# EasyEDA Pro project ProPrj_Maggy 4.1_2025-02-07.epro, schematic Schematic1
Board Name: Board1; Create Date: 2025-01-22; Page Name: P1; Project Name: Maggy 4.0 (Eurocircuit mods); Schematic Name: Schematic1; Update Date: 2025-01-22; Company: NTNU; Drawn: NTNU; Page Size: A4; Part Number: Main Board; Reviewed: 23/10/2024; Version: V4.0
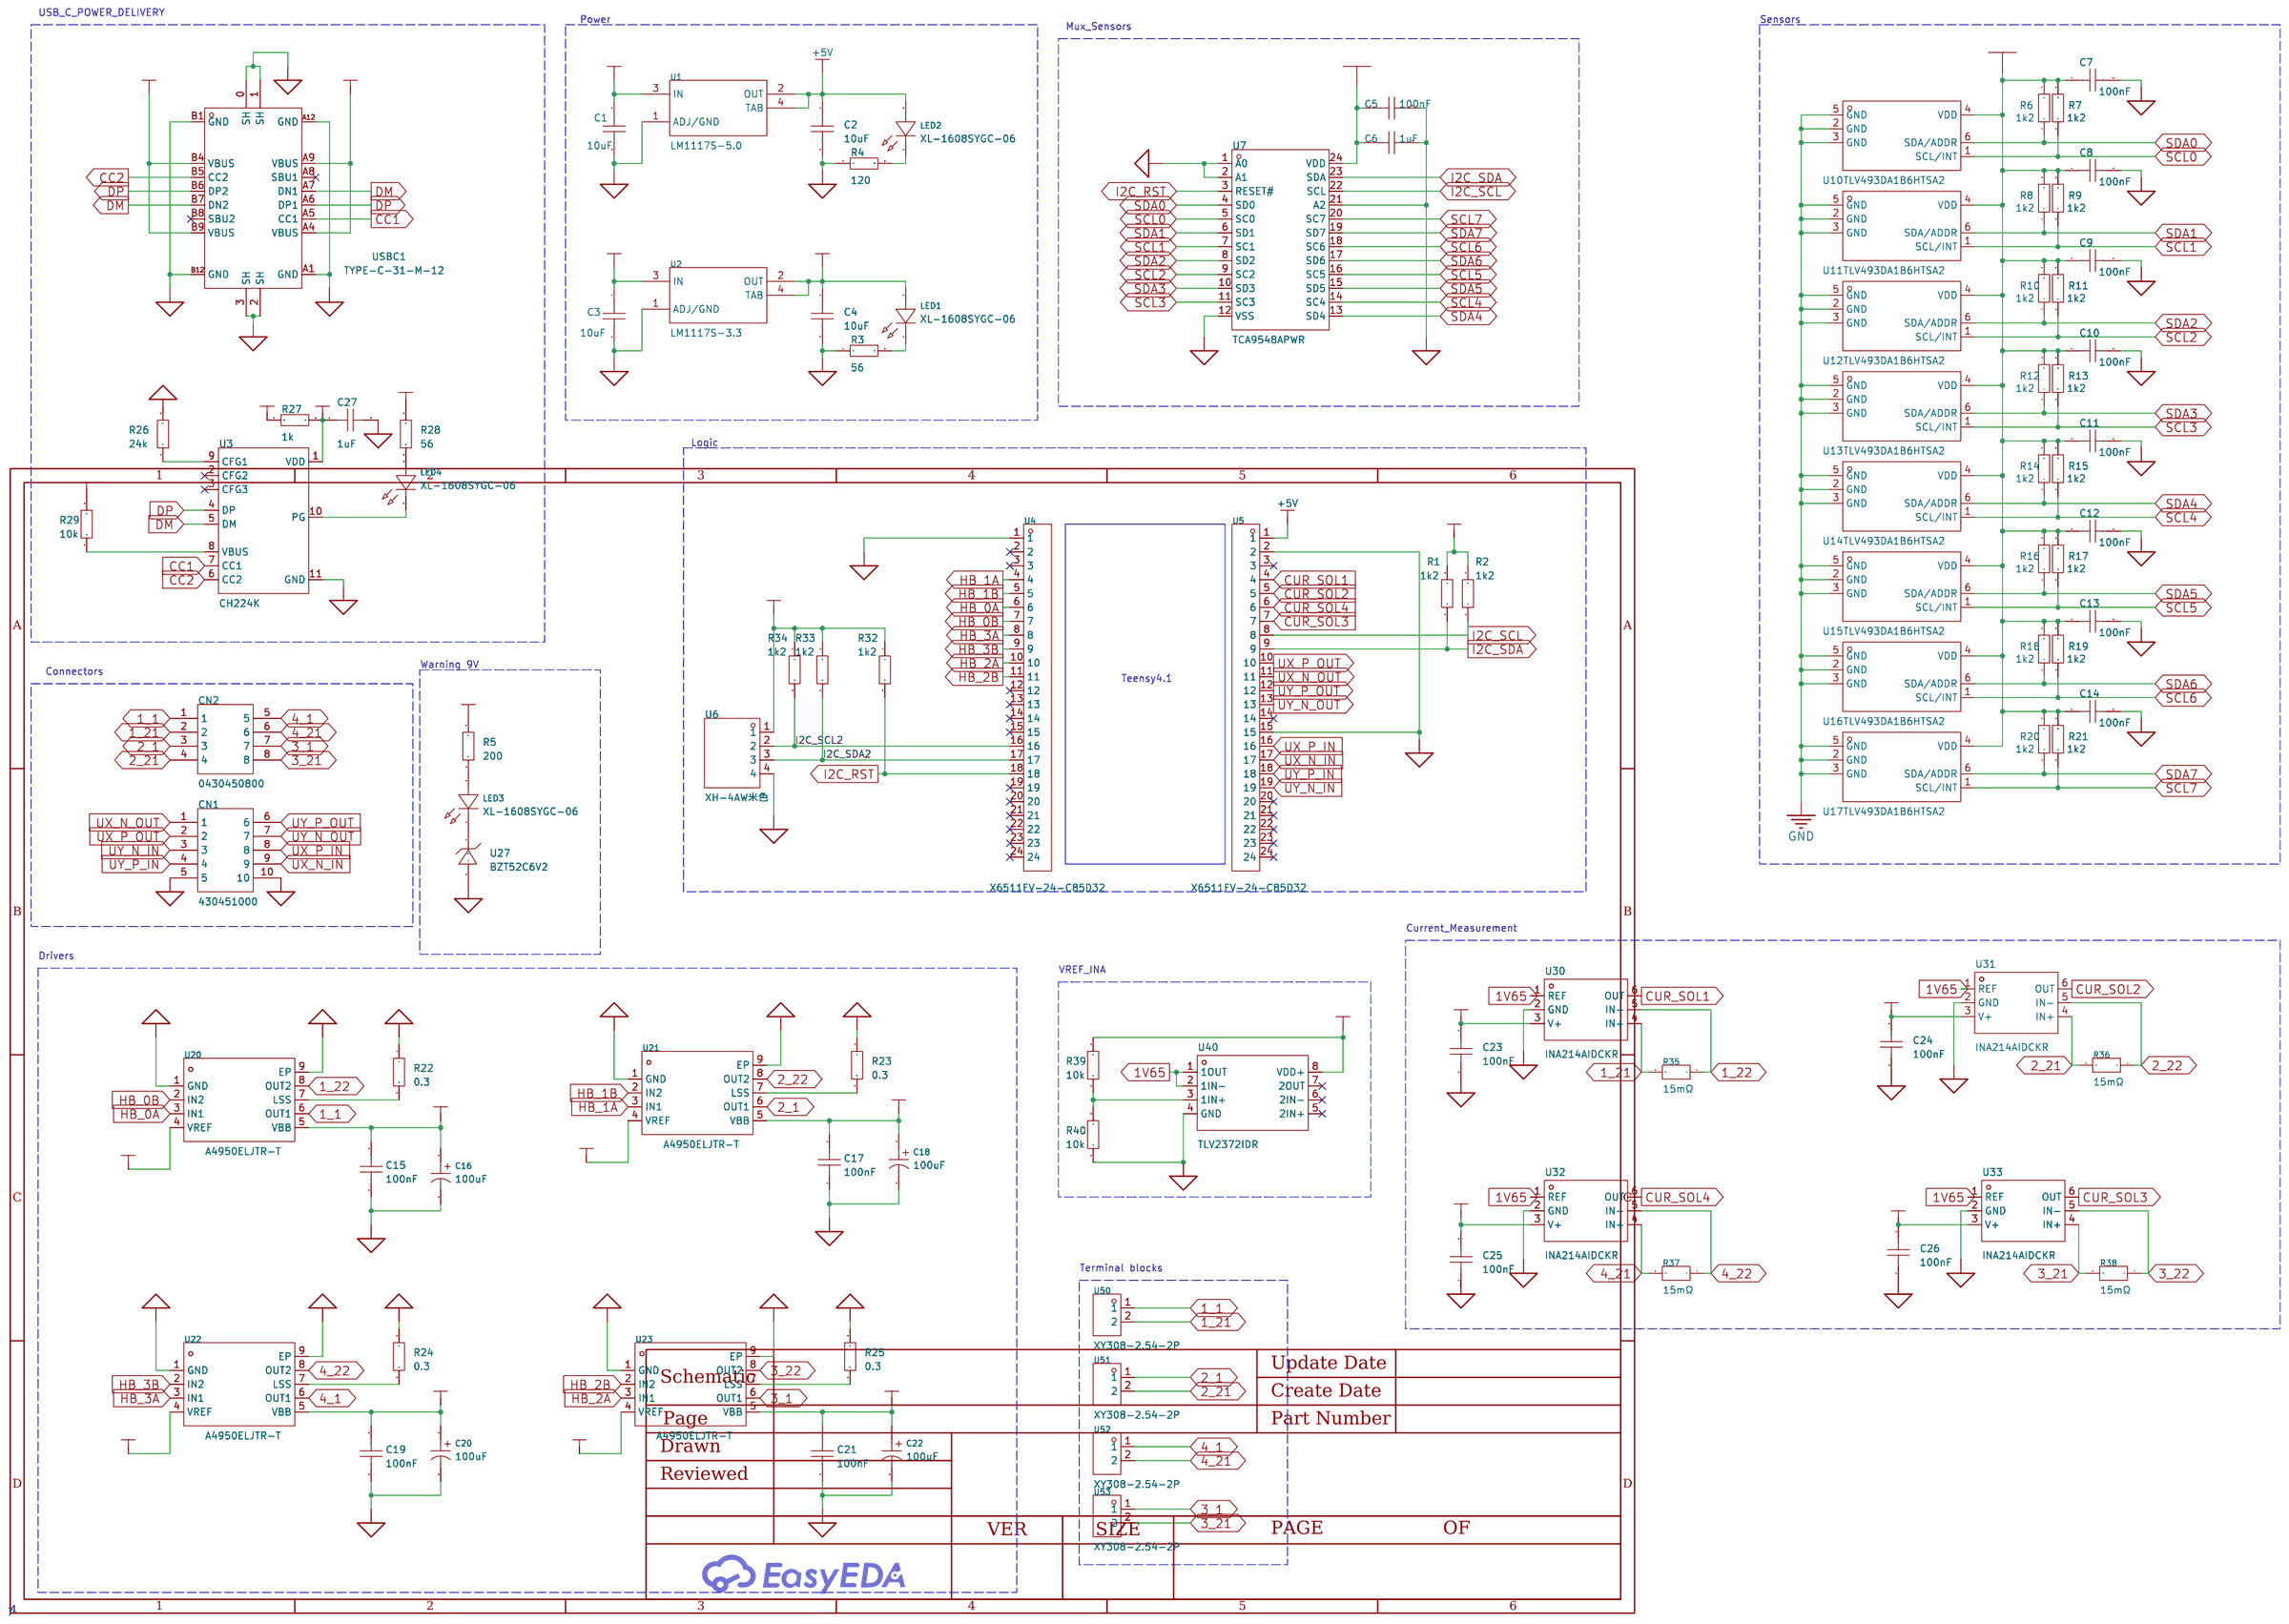
[diagram p0: schematic sheet]

## Parts
C1  10uF  [C0805]
C2  10uF  [C0805]
C3  10uF  [C0805]
C4  10uF  [C0805]
C5  100nF  [C0603]
C6  1uF  [C0805]
C7  100nF  [C0603]
C8  100nF  [C0603]
C9  100nF  [C0603]
C10  100nF  [C0603]
C11  100nF  [C0603]
C12  100nF  [C0603]
C13  100nF  [C0603]
C14  100nF  [C0603]
C15  100nF  [C0603]
C16  100uF  [CAP-SMD_BD6.3-L6.6-W6.6-LS7.2-FD]
C17  100nF  [C0603]
C18  100uF  [CAP-SMD_BD6.3-L6.6-W6.6-LS7.2-FD]
C19  100nF  [C0603]
C20  100uF  [CAP-SMD_BD6.3-L6.6-W6.6-LS7.2-FD]
C21  100nF  [C0603]
C22  100uF  [CAP-SMD_BD6.3-L6.6-W6.6-LS7.2-FD]
C23  100nF  [C0603]
C24  100nF  [C0603]
C25  100nF  [C0603]
C26  100nF  [C0603]
C27  1uF  [C0805]
CN1  430451000  [CONN-TH_43045-1000]
CN2  0430450800  [CONN-TH_0430450800]
LED1  XL-1608SYGC-06  [LED0603-RD_GREEN]
LED2  XL-1608SYGC-06  [LED0603-RD_GREEN]
LED3  XL-1608SYGC-06  [LED0603-RD_GREEN]
LED4  XL-1608SYGC-06  [LED0603-RD_GREEN]
R1  1k2  [R0805]
R2  1k2  [R0805]
R3  56  [R0603]
R4  120  [R0603]
R5  200  [R0603]
R6  1k2  [R0805]
R7  1k2  [R0805]
R8  1k2  [R0805]
R9  1k2  [R0805]
R10  1k2  [R0805]
R11  1k2  [R0805]
R12  1k2  [R0805]
R13  1k2  [R0805]
R14  1k2  [R0805]
R15  1k2  [R0805]
R16  1k2  [R0805]
R17  1k2  [R0805]
R18  1k2  [R0805]
R19  1k2  [R0805]
R20  1k2  [R0805]
R21  1k2  [R0805]
R22  0.3  [R1206]
R23  0.3  [R1206]
R24  0.3  [R1206]
R25  0.3  [R1206]
R26  24k  [R0805]
R27  1k  [R0805]
R28  56  [R0603]
R29  10k  [R0805]
R32  1k2  [R0805]
R33  1k2  [R0805]
R34  1k2  [R0805]
R35  15mΩ  [R1206]
R36  15mΩ  [R1206]
R37  15mΩ  [R1206]
R38  15mΩ  [R1206]
R39  10k  [R0805]
R40  10k  [R0805]
U1  LM1117S-5.0  [SOT-223-3_L6.5-W3.4-P2.30-LS7.0-BR]
U2  LM1117S-3.3  [SOT-223-3_L6.5-W3.4-P2.30-LS7.0-BR]
U3  CH224K  [ESSOP-10_L4.9-W3.9-P1.0-LS6.0-TL-EP]
U4  X6511FV-24-C85D32  [HDR-TH_24P-P2.54-V-F]
U5  X6511FV-24-C85D32  [HDR-TH_24P-P2.54-V-F]
U6  XH-4AW米色  [CONN-TH_XH2.54-4AW]
U7  TCA9548APWR  [TSSOP-24_L7.8-W4.4-P0.65-LS6.4-BL]
U10  TLV493DA1B6HTSA2  [SOP-6_L3.0-W1.5-P0.95-LS2.5-BR]
U11  TLV493DA1B6HTSA2  [SOP-6_L3.0-W1.5-P0.95-LS2.5-BR]
U12  TLV493DA1B6HTSA2  [SOP-6_L3.0-W1.5-P0.95-LS2.5-BR]
U13  TLV493DA1B6HTSA2  [SOP-6_L3.0-W1.5-P0.95-LS2.5-BR]
U14  TLV493DA1B6HTSA2  [SOP-6_L3.0-W1.5-P0.95-LS2.5-BR]
U15  TLV493DA1B6HTSA2  [SOP-6_L3.0-W1.5-P0.95-LS2.5-BR]
U16  TLV493DA1B6HTSA2  [SOP-6_L3.0-W1.5-P0.95-LS2.5-BR]
U17  TLV493DA1B6HTSA2  [SOP-6_L3.0-W1.5-P0.95-LS2.5-BR]
U20  A4950ELJTR-T  [SOIC-8_L4.9-W3.9-P1.27-LS6.0-BL-EP]
U21  A4950ELJTR-T  [SOIC-8_L4.9-W3.9-P1.27-LS6.0-BL-EP]
U22  A4950ELJTR-T  [SOIC-8_L4.9-W3.9-P1.27-LS6.0-BL-EP]
U23  A4950ELJTR-T  [SOIC-8_L4.9-W3.9-P1.27-LS6.0-BL-EP]
U27  BZT52C6V2  [SOD-123_L2.7-W1.6-LS3.7-RD]
U30  INA214AIDCKR  [SC-70-6_L2.2-W1.3-P0.65-LS2.2-BR]
U31  INA214AIDCKR  [SC-70-6_L2.2-W1.3-P0.65-LS2.2-BR]
U32  INA214AIDCKR  [SC-70-6_L2.2-W1.3-P0.65-LS2.2-BR]
U33  INA214AIDCKR  [SC-70-6_L2.2-W1.3-P0.65-LS2.2-BR]
U40  TLV2372IDR  [SOIC-8_L4.9-W3.9-P1.27-LS6.0-BL]
U50  XY308-2.54-2P  [CONN-TH_XY308-2.54-2P]
U51  XY308-2.54-2P  [CONN-TH_XY308-2.54-2P]
U52  XY308-2.54-2P  [CONN-TH_XY308-2.54-2P]
U53  XY308-2.54-2P  [CONN-TH_XY308-2.54-2P]
USBC1  TYPE-C-31-M-12  [USB-C_SMD-TYPE-C-31-M-12]

## Library data of the parts
C1-C4 C27 = CAP_0805: Supplier Footprint: 0805; Check: false
C5 C7-C14 C23-C26 = CAP_0603: Supplier Footprint: 0603
C6 = CAP_0805: Supplier Footprint: 0805
C15 C17 C19 C21 = CAP_0603: Supplier Footprint: 0603; Check: false
C16 C18 C20 C22 = RST100UF35V009: Capacitance: Tolerance:±20% Tolerance:±20% Rated Voltage: Ripple Current:84mA@120Hz Equivalent Series Resistance(ESR):- φD: L: Lifetime @ Temp:2000hrs@105℃ Operating Temperature:-40℃~+105℃ Operating Temperature:-40℃~+105℃; LCSC Part Name: 100uF ±20% 35V; Supplier Part: C4747966; Manufacturer: KNSCHA(科尼盛); Supplier Footprint: SMD,D6.3xL7.7mm; JLCPCB Part Class: Extended Part; Datasheet: https://atta.szlcsc.com/upload/public/pdf/source/20220728/EE5FCA44287011E134FD5BDD3E8B91F9.pdf; Supplier: LCSC; Tolerance: ±20%; Ripple Current: 84mA@120Hz; Lifetime @ Temp: 2000hrs@105℃; Operating Temperature: -40℃~+105℃
CN1 = 430451000: Pins Structure:2x5P Pitch:3mm Mounting Style:Bend insert Reference Series:Micro-Fit(MX 3.0) Number of Pins:10P Number of Rows:2 Number of PINs Per Row:5 Row Spacing:3mm Current Rating (Max):8.5A Contact Material:Brass Contact Plating:Tin Operating Tempera; LCSC Part Name: 2x5P 间距:3mm 弯插 系列:Micro-Fit(MX 3.0); Supplier Part: C122421; Manufacturer: MOLEX; Supplier Footprint: 弯插,P=3mm; JLCPCB Part Class: Extended Part; Supplier: LCSC; Pins Structure: 2x5P; Pitch: 3mm; Mounting Style: Bend insert; Reference Series: Micro-Fit(MX 3.0); Number of Pins: 10P; Number of Rows: 2; Number of PINs Per Row: 5; Row Spacing: 3mm; Current Rating (Max): 8.5A; Contact Material: Brass; Contact Plating: Tin; Operating Temperature Range: -40℃~+105℃; Rated Voltage (Max): 600V; Flame Retardant Rating: UL94V-0; Supplementary Features: Fishhook Foot (Plastic); Colour: Black; Z-Height of the Board: 8.77mm; X-Length of Bottom Edge on Board (Spacing Line): 18.65mm; Y-Width of Bottom Edge on Board: 12.24mm
CN2 = 0430450800: Pins Structure:2x4P Pitch:3mm Mounting Style:Bend insert Reference Series:Micro-Fit(MX 3.0) Number of Pins:8P Number of Rows:2 Number of PINs Per Row:4 Row Spacing:3mm Current Rating (Max):8.5A Contact Material:Brass Contact Plating:Tin Operating Temperat; LCSC Part Name: 2x4P 间距:3mm 弯插 系列:Micro-Fit(MX 3.0); Supplier Part: C122422; Manufacturer: MOLEX; Supplier Footprint: 弯插,P=3mm; JLCPCB Part Class: Extended Part; Supplier: LCSC; Pins Structure: 2x4P; Pitch: 3mm; Mounting Style: Bend insert; Reference Series: Micro-Fit(MX 3.0); Number of Pins: 8P; Number of Rows: 2; Number of PINs Per Row: 4; Row Spacing: 3mm; Current Rating (Max): 8.5A; Contact Material: Brass; Contact Plating: Tin; Operating Temperature Range: -40℃~+105℃; Rated Voltage (Max): 600V; Flame Retardant Rating: UL94V-0; Supplementary Features: Fishhook Foot (Plastic); Colour: Black; Z-Height of the Board: 8.77mm; X-Length of Bottom Edge on Board (Spacing Line): 15.65mm; Y-Width of Bottom Edge on Board: 12.24mm
LED1 LED3 LED4 = XL-1608SYGC-06: Emitted Color:Green-yellow Power Dissipation:55mW Forward Current:25mA Dominant Wavelength:570nm~573nm Dominant Wavelength:570nm~573nm Peak Wavelength:575nm Lens Color:无色透明透镜 Color Temperature:2800K~3160K Color Temperature:2800K~3160K Viewing Angle:120° M; Supplier Part: C965805; Manufacturer: XINGLIGHT(成兴光); Supplier Footprint: 0603; JLCPCB Part Class: Extended Part; Datasheet: https://atta.szlcsc.com/upload/public/pdf/source/20221102/F362183196D461585F90F08511E6DE2E.pdf; Supplier: LCSC; Emitted Color: Green-yellow; Power Dissipation: 55mW; Forward Current: 25mA; Dominant Wavelength: 570nm~573nm; Peak Wavelength: 575nm; Lens Color: 无色透明透镜; Color Temperature: 2800K~3160K; Viewing Angle: 120°; Mounting Sytle: Positive post; Operating Temperature: -30℃~+85℃; Check: false
LED2 = XL-1608SYGC-06: Emitted Color:Green-yellow Power Dissipation:55mW Forward Current:25mA Dominant Wavelength:570nm~573nm Dominant Wavelength:570nm~573nm Peak Wavelength:575nm Lens Color:无色透明透镜 Color Temperature:2800K~3160K Color Temperature:2800K~3160K Viewing Angle:120° M; Supplier Part: C965805; Manufacturer: XINGLIGHT(成兴光); Supplier Footprint: 0603; JLCPCB Part Class: Extended Part; Datasheet: https://atta.szlcsc.com/upload/public/pdf/source/20221102/F362183196D461585F90F08511E6DE2E.pdf; Supplier: LCSC; Emitted Color: Green-yellow; Power Dissipation: 55mW; Forward Current: 25mA; Dominant Wavelength: 570nm~573nm; Peak Wavelength: 575nm; Lens Color: 无色透明透镜; Color Temperature: 2800K~3160K; Viewing Angle: 120°; Mounting Sytle: Positive post; Operating Temperature: -30℃~+85℃
R1 R2 R26 R27 R29 R39 R40 = Res_0805: Supplier Footprint: 0805; Check: false
R3-R5 R28 R32-R34 = Res_0603: Supplier Footprint: 0603; Check: false
R6-R21 = Res_0805: Supplier Footprint: 0805
R22-R25 = Res_1206: Supplier Footprint: 1206; Check: false
R35-R38 = 1206W3F100MT5E: Type:Thick Film Resistors Resistance:10mΩ Tolerance:±1% Tolerance:±1% Power(Watts): Overload Voltage (Max): Temperature Coefficient:- Temperature Coefficient:- Operating Temperature Range:-55℃~+155℃ Operating Temperature Range:-55℃~+155℃; LCSC Part Name: 10mΩ ±1% 333.333mW 厚膜电阻; Supplier Part: C473031; Manufacturer: UNI-ROYAL(厚声); Supplier Footprint: 1206; JLCPCB Part Class: Extended Part; Datasheet: https://atta.szlcsc.com/upload/public/pdf/source/20200306/C422600_1E6D84923E4A46A82E41ADD87F860B5C.pdf; Supplier: LCSC; Type: Thick Film Resistors; Tolerance: ±1%; Operating Temperature Range: -55℃~+155℃
U1 = LM1117S-5.0: Output Type: Maximum Input Voltage:12V Output Voltage:5V Output Voltage:5V MAX Output Current:1A Power Supply Rejection Ratio (PSRR):75dB@(120Hz) Dropout Voltage:1.3V@(1A) Output Polarity:Positive electrode Number of Outputs:1; Supplier: LCSC; Manufacturer: HTC; Supplier Part: C126028; JLCPCB Part Class: Extended Part; LCSC Part Name: 输入12V 输出5V 1A; Supplier Footprint: SOT-223-3; Datasheet: https://atta.szlcsc.com/upload/public/pdf/source/20170814/C126029_1502678374361885901.pdf; Maximum Input Voltage: 12V; Output Voltage: 5V; MAX Output Current: 1A; Power Supply Rejection Ratio (PSRR): 75dB@(120Hz); Dropout Voltage: 1.3V@(1A); Output Polarity: Positive electrode; Number of Outputs: 1; Check: false
U2 = LM1117S-3.3: Output Type: Maximum Input Voltage:12V Output Voltage:3.3V Output Voltage:3.3V MAX Output Current:1A Power Supply Rejection Ratio (PSRR):75dB@(120Hz) Dropout Voltage:1.3V@(1A) Output Polarity:Positive electrode Number of Outputs:1; Supplier: LCSC; Manufacturer: HTC; Supplier Part: C126027; JLCPCB Part Class: Extended Part; LCSC Part Name: 输入12V 输出3.3V 1A; Supplier Footprint: SOT-223-3; Datasheet: https://atta.szlcsc.com/upload/public/pdf/source/20170814/C126029_1502678374361885901.pdf; Maximum Input Voltage: 12V; Output Voltage: 3.3V; MAX Output Current: 1A; Power Supply Rejection Ratio (PSRR): 75dB@(120Hz); Dropout Voltage: 1.3V@(1A); Output Polarity: Positive electrode; Number of Outputs: 1; Check: false
U3 = CH224K: Applications Function:USB充电芯片; LCSC Part Name: USB PD等多快充协议受电芯片CH224; Supplier Part: C970725; Manufacturer: WCH(南京沁恒); Supplier Footprint: ESSOP-10-150mil-1mm; JLCPCB Part Class: Extended Part; Datasheet: https://atta.szlcsc.com/upload/public/pdf/source/20240313/43C2AFDDBDD1F65B60386D2CCAB0811B.pdf; Supplier: LCSC; Applications Function: USB充电芯片
U4 U5 = X6511FV-24-C85D32: Holes Structure:1x24P Pitch:2.54mm Row Spacing:- Circular Hole / Square Hole:Square Holes Mounting Type:Straight Number of Rows:Plugin Number of Holes:24P Current Rating (Max):3A Voltage Rating (Max):250V Holes Direction:Top Insulation Height:8.5mm Contac; LCSC Part Name: 间距:2.54mm 1x24P 直插; Supplier Part: C2883741; Manufacturer: XKB Connectivity(中国星坤); Supplier Footprint: 插件,P=2.54mm; JLCPCB Part Class: Extended Part; Datasheet: https://atta.szlcsc.com/upload/public/pdf/source/20211009/E31A179D77B4765F9C2936200B697B47.pdf; Supplier: LCSC; Holes Structure: 1x24P; Pitch: 2.54mm; Circular Hole / Square Hole: Square Holes; Mounting Type: Straight; Number of Rows: Plugin; Number of Holes: 24P; Current Rating (Max): 3A; Voltage Rating (Max): 250V; Holes Direction: Top; Insulation Height: 8.5mm; Contact Material: Brass; Contact Plating: Gold; Operating Temperature Range: -40℃~+105℃; Soldering Temperature(Max): 260℃
U6 = XH-4AW米色: Pins Structure:1x4P Pitch:2.5mm Mounting Style:Right-Angle Reference Series:XH Number of Pins:4P Number of Rows:1 Number of PINs Per Row:4 Row Spacing:- Contact Material:-; LCSC Part Name: 系列:XH 间距:2.5mm 1x4P; Supplier Part: C146115; Manufacturer: BOOMELE(博穆精密); Supplier Footprint: 弯插,P=2.5mm; JLCPCB Part Class: Extended Part; Datasheet: https://atta.szlcsc.com/upload/public/pdf/source/20171115/C146119_15107294155991120596.pdf; Supplier: LCSC; Pins Structure: 1x4P; Pitch: 2.5mm; Mounting Style: Right-Angle; Reference Series: XH; Number of Pins: 4P; Number of Rows: 1; Number of PINs Per Row: 4; Check: false
U7 = TCA9548APWR: Supplier Part: C130026; Manufacturer: TI(德州仪器); Supplier Footprint: TSSOP-24; JLCPCB Part Class: Extended Part; Datasheet: https://www.ti.com/cn/lit/gpn/tca9548a; Supplier: LCSC
U10-U17 = TLV493DA1B6HTSA2: Supplier: LCSC; Manufacturer: Infineon(英飞凌); Supplier Part: C126688; JLCPCB Part Class: Extended Part; LCSC Part Name: 磁场传感器; Supplier Footprint: SOP-6-1.5mm; Datasheet: https://atta.szlcsc.com/upload/public/pdf/source/20170818/C126688_1503051290851895354.pdf
U20-U23 = A4950ELJTR-T: Drive motor type:有刷直流电机 Supply Voltage:8V~40V Supply Voltage:8V~40V Output Current:3.5A Operating Temperature:-40℃~+150℃@(Tj) Operating Temperature:-40℃~+150℃@(Tj); Supplier: LCSC; Manufacturer: ALLEGRO(美国埃戈罗); Supplier Part: C82404; JLCPCB Part Class: Extended Part; Supplier Footprint: SOIC-8-EP; Datasheet: https://atta.szlcsc.com/upload/public/pdf/source/20161024/1477288450284.pdf; Drive motor type: 有刷直流电机; Supply Voltage: 8V~40V; Output Current: 3.5A; Operating Temperature: -40℃~+150℃@(Tj); Check: false
U27 = BZT52C6V2_C2910064: Diode Configuration:Single Zener Voltage (Nom):6.2V Reverse Leakage Current (Ir):3uA@4V Zener Voltage (Range):5.8V~6.6V Zener Voltage (Range):5.8V~6.6V Power Dissipation:500mW Zener Impedance (Zzt):10Ω Tolerance:- Tolerance:-; Supplier Part: C2910064; Manufacturer: CJ(江苏长电/长晶); Supplier Footprint: SOD-123; JLCPCB Part Class: Extended Part; Datasheet: https://atta.szlcsc.com/upload/public/pdf/source/20211105/0A7AF84D57D732370551C8DD7A10F563.pdf; Supplier: LCSC; Diode Configuration: Single; Zener Voltage (Nom): 6.2V; Reverse Leakage Current (Ir): 3uA@4V; Zener Voltage (Range): 5.8V~6.6V; Power Dissipation: 500mW; Zener Impedance (Zzt): 10Ω
U30-U33 = INA214AIDCKR: Number of Channels:Single channel Supply Current:65uA Operating Temperature:-40℃~+125℃ Operating Temperature:-40℃~+125℃; Supplier Part: C105240; Manufacturer: TI(德州仪器); Supplier Footprint: SOT-363(SC-70-6); JLCPCB Part Class: Extended Part; Datasheet: https://www.ti.com/cn/lit/gpn/ina214; Supplier: LCSC; Number of Channels: Single channel; Supply Current: 65uA; Operating Temperature: -40℃~+125℃
U40 = TLV2372IDR: Number of Circuits:双路 Gain Bandwidth Product(GBP):3MHz Current - Input Bias(Ib):1pA Slew Rate(SR):2.1V/us Output Current:16mA -3db Bandwidth:- Output Type:- Rail to Rail:- Operating Temperature:-40℃~+125℃ Operating Temperature:-40℃~+125℃; Supplier Part: C27204; Manufacturer: TI(德州仪器); Supplier Footprint: SOIC-8; JLCPCB Part Class: Extended Part; Datasheet: https://www.ti.com/cn/lit/gpn/tlv2372; Supplier: LCSC; Number of Circuits: 双路; Gain Bandwidth Product(GBP): 3MHz; Current - Input Bias(Ib): 1pA; Slew Rate(SR): 2.1V/us; Output Current: 16mA; Operating Temperature: -40℃~+125℃
U50-U53 = XY308-2.54-2P: Structure:1x2P Pitch:2.54mm Color:Green Mounting Style:Straight Current Rating (Max):6A Voltage Rating (Max):150V Number of Pins:2P Number of Rows:1 Wire Gauge - AWG:18~26 Wire Gauge - AWG:18~26 Wire Gauge - mm2:1 Wire Gauge - mm2:1 Number of PINs Per Row; LCSC Part Name: 2.54mm 1x2P 排数:1 每排P数:2 直插; Supplier Part: C557685; Manufacturer: XINLAIYA(新莱亚); Supplier Footprint: 插件,P=2.54mm; JLCPCB Part Class: Extended Part; Datasheet: https://atta.szlcsc.com/upload/public/pdf/source/20200527/C557686_13715264167F455C722D771DE12648FD.pdf; Supplier: LCSC; Structure: 1x2P; Pitch: 2.54mm; Color: Green; Mounting Style: Straight; Current Rating (Max): 6A; Voltage Rating (Max): 150V; Number of Pins: 2P; Number of Rows: 1; Wire Gauge - AWG: 18~26; Wire Gauge - mm2: 1; Number of PINs Per Row: 2; Check: false
USBC1 = TYPE-C-31-M-12: Connector Type:Type-C Standard:- Gender:Female Number of Ports:1 Number of Contacts:16P Mounting Style:- Current Rating - Power (Max):5A Contact Material:- Contact Plating:- Operating Temperature Range:- Operating Temperature Range:- Soldering Temperature; LCSC Part Name: Type-C 母; Supplier Part: C165948; Manufacturer: 韩国韩荣; Supplier Footprint: SMD; JLCPCB Part Class: Extended Part; Datasheet: https://atta.szlcsc.com/upload/public/pdf/source/20220525/466408E853115E789EDB0DDC29077C05.pdf; Supplier: LCSC; Connector Type: Type-C; Gender: Female; Number of Ports: 1; Number of Contacts: 16P; Current Rating - Power (Max): 5A

## Nets
1V65: U30.1(REF) U31.1(REF) U32.1(REF) U33.1(REF) U40.1(1OUT) U40.2(1IN-)
3V3: C4.1 C5.1 C6.2 C7.1 C8.1 C9.1 C10.1 C11.1 C12.1 C13.1 C14.1 C23.2 C24.2 C25.2 C26.2 C27.1 LED1.2(A) R1.2 R2.2 R6.2 R7.2 R8.2 R9.2 R10.2 R11.2 R12.2 R13.2 R14.2 R15.2 R16.2 R17.2 R18.2 R19.2 R20.2 R21.2 R27.1 R28.2 R32.1 R33.1 R34.1 R39.2 U2.2(OUT) U2.4(TAB) U3.1(VDD) U6.1 U7.24(VDD) U10.4(VDD) U11.4(VDD) U12.4(VDD) U13.4(VDD) U14.4(VDD) U15.4(VDD) U16.4(VDD) U17.4(VDD) U20.4(VREF) U21.4(VREF) U22.4(VREF) U23.4(VREF) U30.3(V+) U31.3(V+) U32.3(V+) U33.3(V+) U40.8(VDD+)
+5V: C2.1 LED2.2(A) U1.2(OUT) U1.4(TAB) U5.1
GND: C1.2 C2.2 C3.2 C4.2 C5.2 C6.1 C7.2 C8.2 C9.2 C10.2 C11.2 C12.2 C13.2 C14.2 C15.2 C16.2 C17.2 C18.2 C19.2 C20.2 C21.2 C22.2 C23.1 C24.1 C25.1 C26.1 C27.2 CN1.5 CN1.10 R3.1 R4.1 R22.1 R23.1 R24.1 R25.1 R26.2 R40.1 U1.1(ADJ/GND) U2.1(ADJ/GND) U3.11(GND) U4.1 U5.2 U5.15 U6.4 U7.1(A0) U7.2(A1) U7.12(VSS) U7.21(A2) U10.2(GND) U10.3(GND) U10.5(GND) U11.2(GND) U11.3(GND) U11.5(GND) U12.2(GND) U12.3(GND) U12.5(GND) U13.2(GND) U13.3(GND) U13.5(GND) U14.2(GND) U14.3(GND) U14.5(GND) U15.2(GND) U15.3(GND) U15.5(GND) U16.2(GND) U16.3(GND) U16.5(GND) U17.2(GND) U17.3(GND) U17.5(GND) U20.1(GND) U20.9(EP) U21.1(GND) U21.9(EP) U22.1(GND) U22.9(EP) U23.1(GND) U23.9(EP) U27.2(A) U30.2(GND) U31.2(GND) U32.2(GND) U33.2(GND) U40.4(GND) USBC1.0(SH) USBC1.1(SH) USBC1.2(SH) USBC1.3(SH) USBC1.A1(GND) USBC1.A12(GND) USBC1.B1(GND) USBC1.B12(GND)
VBUS: C1.1 C3.1 C15.1 C16.1 C17.1 C18.1 C19.1 C20.1 C21.1 C22.1 R5.2 R27.2 R29.2 U1.3(IN) U2.3(IN) U20.5(VBB) U21.5(VBB) U22.5(VBB) U23.5(VBB) USBC1.A4(VBUS) USBC1.A9(VBUS) USBC1.B4(VBUS) USBC1.B9(VBUS)
1_1: CN2.1 U20.6(OUT1) U50.1
1_21: CN2.2 R35.2 U30.4(IN+) U50.2
1_22: R35.1 U20.8(OUT2) U30.5(IN-)
2_1: CN2.3 U21.6(OUT1) U51.1
2_21: CN2.4 R36.2 U31.4(IN+) U51.2
2_22: R36.1 U21.8(OUT2) U31.5(IN-)
3_1: CN2.7 U23.6(OUT1) U53.1
3_21: CN2.8 R38.2 U33.4(IN+) U53.2
3_22: R38.1 U23.8(OUT2) U33.5(IN-)
4_1: CN2.5 U22.6(OUT1) U52.1
4_21: CN2.6 R37.2 U32.4(IN+) U52.2
4_22: R37.1 U22.8(OUT2) U32.5(IN-)
CC1: U3.7(CC1) USBC1.A5(CC1)
CC2: U3.6(CC2) USBC1.B5(CC2)
CUR_SOL1: U5.4 U30.6(OUT)
CUR_SOL2: U5.5 U31.6(OUT)
CUR_SOL3: U5.7 U33.6(OUT)
CUR_SOL4: U5.6 U32.6(OUT)
DM: U3.5(DM) USBC1.A7(DN1) USBC1.B7(DN2)
DP: U3.4(DP) USBC1.A6(DP1) USBC1.B6(DP2)
HB_0A: U4.6 U20.3(IN1)
HB_0B: U4.7 U20.2(IN2)
HB_1A: U4.4 U21.3(IN1)
HB_1B: U4.5 U21.2(IN2)
HB_2A: U4.10 U23.3(IN1)
HB_2B: U4.11 U23.2(IN2)
HB_3A: U4.8 U22.3(IN1)
HB_3B: U4.9 U22.2(IN2)
I2C_RST: R32.2 U4.18 U7.3(RESET#)
I2C_SCL: R2.1 U5.8 U7.22(SCL)
I2C_SCL2: R34.2 U4.16 U6.2
I2C_SDA: R1.1 U5.9 U7.23(SDA)
I2C_SDA2: R33.2 U4.17 U6.3
SCL0: R7.1 U7.5(SC0) U10.1(SCL/INT)
SCL1: R9.1 U7.7(SC1) U11.1(SCL/INT)
SCL2: R11.1 U7.9(SC2) U12.1(SCL/INT)
SCL3: R13.1 U7.11(SC3) U13.1(SCL/INT)
SCL4: R15.1 U7.14(SC4) U14.1(SCL/INT)
SCL5: R17.1 U7.16(SC5) U15.1(SCL/INT)
SCL6: R19.1 U7.18(SC6) U16.1(SCL/INT)
SCL7: R21.1 U7.20(SC7) U17.1(SCL/INT)
SDA0: R6.1 U7.4(SD0) U10.6(SDA/ADDR)
SDA1: R8.1 U7.6(SD1) U11.6(SDA/ADDR)
SDA2: R10.1 U7.8(SD2) U12.6(SDA/ADDR)
SDA3: R12.1 U7.10(SD3) U13.6(SDA/ADDR)
SDA4: R14.1 U7.13(SD4) U14.6(SDA/ADDR)
SDA5: R16.1 U7.15(SD5) U15.6(SDA/ADDR)
SDA6: R18.1 U7.17(SD6) U16.6(SDA/ADDR)
SDA7: R20.1 U7.19(SD7) U17.6(SDA/ADDR)
UX_N_IN: CN1.9 U5.17
UX_N_OUT: CN1.1 U5.11
UX_P_IN: CN1.8 U5.16
UX_P_OUT: CN1.2 U5.10
UY_N_IN: CN1.3 U5.19
UY_N_OUT: CN1.7 U5.13
UY_P_IN: CN1.4 U5.18
UY_P_OUT: CN1.6 U5.12
$1N3748: R22.2 U20.7(LSS)
$1N3820: LED2.1(K) R4.2
$1N3821: LED1.1(K) R3.2
$1N8157: R26.1 U3.9(CFG1)
$1N8202: R29.1 U3.8(VBUS)
$1N8651: R23.2 U21.7(LSS)
$1N8936: R24.2 U22.7(LSS)
$1N9221: R25.2 U23.7(LSS)
$1N10392: LED4.1(K) U3.10(PG)
$1N10465: LED4.2(A) R28.1
$1N10718: LED3.1(K) U27.1(C)
$1N10720: LED3.2(A) R5.1
$1N18521: R39.1 R40.2 U40.3(1IN+)

Not connected (* = marked no-connect by the designer): U3 2(CFG2)* 3(CFG3)*; U4 2* 3* 12* 13* 14* 15* 19* 20* 21* 22* 23* 24*; U5 3* 14* 20* 21* 22* 23* 24*; U40 5(2IN+)* 6(2IN-)* 7(2OUT)*; USBC1 A8(SBU1)* B8(SBU2)*

## Notes on the sheet
- USB_C_POWER_DELIVERY
- Power
- Mux_Sensors
- Sensors
- Logic
- Warning 9V
- Connectors
- Teensy4.1
- Current_Measurement
- Drivers
- VREF_INA
- Terminal blocks
